# Altium project Kasli-SOC.PrjPcb (part 11 of 11)

## Sheet Kasli-SOC_ETH_PHY.SchDoc: Ethernet
size 420 x 297 mm; CheckedBy: G.Kasprowicz; Author: F.Switakowski; CompanyName: WUT ISE; DrawnBy: F.Switakowski; Organization: WUT ISE; Address1: PW ISE; Address2: Nowowiejska 15/19 00-665 Warsaw; Address3: gkasprow@gmail.com; DocumentNumber: 13; Revision: 1; SheetNumber: 13; SheetTotal: 18; ModifiedBy: -; CheckedDate: -; Title2: PHY; DivGrp: WUT ISE; Designer: G.Kasprowicz; ModifiedDate: -; ProjectName: Sensor Box
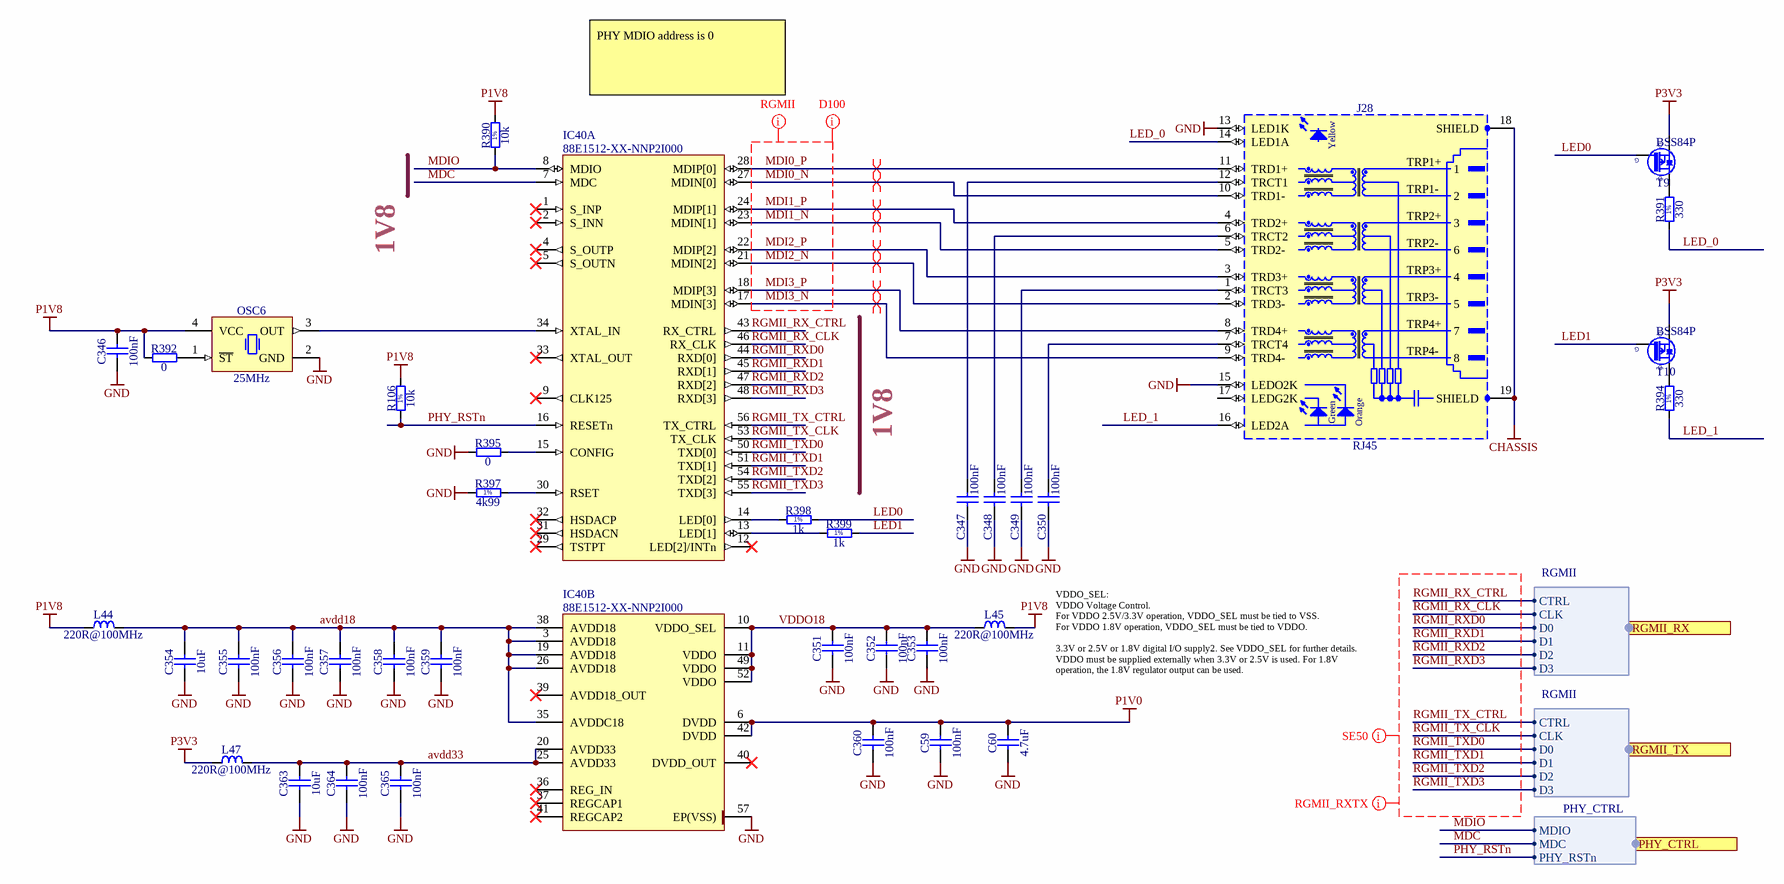
[diagram p17: Kasli-SOC_ETH_PHY.SchDoc]

### Parts
C59  100nF  [CAPC0603X33N]
C60  4.7uF  [CAPC1709X95N]
C346  100nF  [CAPC1005X55N]
C347  100nF  [CAPC1005X55N]
C348  100nF  [CAPC1005X55N]
C349  100nF  [CAPC1005X55N]
C350  100nF  [CAPC1005X55N]
C351  100nF  [CAPC0603X33N]
C352  100nF  [CAPC0603X33N]
C353  100nF  [CAPC0603X33N]
C354  10uF  [CAPC1608X80N]
C355  100nF  [CAPC0603X33N]
C356  100nF  [CAPC0603X33N]
C357  100nF  [CAPC0603X33N]
C358  100nF  [CAPC0603X33N]
C359  100nF  [CAPC0603X33N]
C360  100nF  [CAPC0603X33N]
C363  10uF  [CAPC1608X80N]
C364  100nF  [CAPC0603X33N]
C365  100nF  [CAPC0603X33N]
IC40  88E1512-XX-NNP2I000  [QFN50P800X800X100-57N-S437]  (parts A,B of 2)
J28  RJ45  [BEL_L829-1J1T-43]
L44  220R@100MHz  [INDC2012X105N]
L45  220R@100MHz  [INDC2012X105N]
L47  220R@100MHz  [INDC2012X105N]
OSC6  25MHz  [OSC_MICREL_2520]
R106  10k  [RESC1005X40N]
R390  10k  [RESC1005X40N]
R391  330  [RESC1005X40N]
R392  0  [RESC1005X40N]
R394  330  [RESC1005X40N]
R395  0  [RESC1005X40N]
R397  4k99  [RESC1608X55N]
R398  1k  [RESC1005X40N]
R399  1k  [RESC1005X40N]
T9  BSS84P  [SOT95P240X110-3N]
T10  BSS84P  [SOT95P240X110-3N]

### Ports
PHY_CTRL (harness PHY_CTRL), RGMII_RX (harness RGMII), RGMII_TX (harness RGMII)

### Harnesses
RGMII: CTRL, CLK, D0, D1, D2, D3
PHY_CTRL: MDIO, MDC, PHY_RSTn

### Nets
CHASSIS: J28.18(SHIELD) J28.19(SHIELD)
GND: C59.1 C60.1 C346.1 C347.1 C348.1 C349.1 C350.1 C351.1 C352.1 C353.1 C354.1 C355.1 C356.1 C357.1 C358.1 C359.1 C360.1 C363.1 C364.1 C365.1 IC40.57(EP(VSS)) J28.13(LED1K) J28.15(LEDO2K) OSC6.2(GND) R395.1 R397.1
P1V0: C59.2 C60.2 C360.2 IC40.6(DVDD) IC40.42(DVDD)
P1V8: C346.2 L44.1 L45.2 OSC6.4(VCC) R106.2 R390.2 R392.1
P3V3: L47.1 T9.2(S) T10.2(S)
avdd18: C354.2 C355.2 C356.2 C357.2 C358.2 C359.2 IC40.3(AVDD18) IC40.19(AVDD18) IC40.26(AVDD18) IC40.35(AVDDC18) IC40.38(AVDD18) L44.2
avdd33: C363.2 C364.2 C365.2 IC40.20(AVDD33) IC40.25(AVDD33) L47.2
LED0: R398.2 T9.1(G)
LED1: R399.2 T10.1(G)
LED_0: J28.14(LED1A) R391.1
LED_1: J28.16(LED2A) R394.1
MDC: IC40.7(MDC) ; port PHY_CTRL.MDC
MDI0_N: IC40.27(MDIN[0]) J28.10(TRD1-)
MDI0_P: IC40.28(MDIP[0]) J28.11(TRD1+)
MDI1_N: IC40.23(MDIN[1]) J28.5(TRD2-)
MDI1_P: IC40.24(MDIP[1]) J28.4(TRD2+)
MDI2_N: IC40.21(MDIN[2]) J28.2(TRD3-)
MDI2_P: IC40.22(MDIP[2]) J28.3(TRD3+)
MDI3_N: IC40.17(MDIN[3]) J28.9(TRD4-)
MDI3_P: IC40.18(MDIP[3]) J28.8(TRD4+)
MDIO: IC40.8(MDIO) R390.1 ; port PHY_CTRL.MDIO
PHY_RSTn: IC40.16(RESETn) R106.1 ; port PHY_CTRL.PHY_RSTn
RGMII_RX_CLK: IC40.46(RX_CLK) ; port RGMII_RX.CLK
RGMII_RX_CTRL: IC40.43(RX_CTRL) ; port RGMII_RX.CTRL
RGMII_RXD0: IC40.44(RXD[0]) ; port RGMII_RX.D0
RGMII_RXD1: IC40.45(RXD[1]) ; port RGMII_RX.D1
RGMII_RXD2: IC40.47(RXD[2]) ; port RGMII_RX.D2
RGMII_RXD3: IC40.48(RXD[3]) ; port RGMII_RX.D3
RGMII_TX_CLK: IC40.53(TX_CLK) ; port RGMII_TX.CLK
RGMII_TX_CTRL: IC40.56(TX_CTRL) ; port RGMII_TX.CTRL
RGMII_TXD0: IC40.50(TXD[0]) ; port RGMII_TX.D0
RGMII_TXD1: IC40.51(TXD[1]) ; port RGMII_TX.D1
RGMII_TXD2: IC40.54(TXD[2]) ; port RGMII_TX.D2
RGMII_TXD3: IC40.55(TXD[3]) ; port RGMII_TX.D3
VDDO18: C351.2 C352.2 C353.2 IC40.10(VDDO_SEL) IC40.11(VDDO) IC40.49(VDDO) IC40.52(VDDO) L45.1
NetC347_2: C347.2 J28.12(TRCT1)
NetC348_2: C348.2 J28.6(TRCT2)
NetC349_2: C349.2 J28.1(TRCT3)
NetC350_2: C350.2 J28.7(TRCT4)
NetIC40_13: IC40.13(LED[1]) R399.1
NetIC40_14: IC40.14(LED[0]) R398.1
NetIC40_15: IC40.15(CONFIG) R395.2
NetIC40_30: IC40.30(RSET) R397.2
NetIC40_34: IC40.34(XTAL_IN) OSC6.3(OUT)
NetOSC6_1: OSC6.1(~{ST}) R392.2
NetR391_2: R391.2 T9.3(D)
NetR394_2: R394.2 T10.3(D)

Not connected (* = marked no-connect by the designer): IC40 1(S_INP)* 2(S_INN)* 4(S_OUTP)* 5(S_OUTN)* 9(CLK125)* 12(LED[2]/INTn)* 29(TSTPT)* 31(HSDACN)* 32(HSDACP)* 33(XTAL_OUT)* 36(REG_IN)* 37(REGCAP1)* 39(AVDD18_OUT)* 40(DVDD_OUT)* 41(REGCAP2)*; J28 17(LEDG2K)

### Layout directives
differential pair: MDI0_N, MDI0_P, MDI1_N, MDI1_P, MDI2_N, MDI2_P, MDI3_N, MDI3_P
net class RGMII: MDI0_N, MDI0_P, MDI1_N, MDI1_P, MDI2_N, MDI2_P, MDI3_N, MDI3_P
net class RGMII_RXTX: RGMII_RX_CLK, RGMII_RX_CTRL, RGMII_RXD0, RGMII_RXD1, RGMII_RXD2, RGMII_RXD3, RGMII_TX_CLK, RGMII_TX_CTRL, RGMII_TXD0, RGMII_TXD1, RGMII_TXD2, RGMII_TXD3
net class D100: MDI0_N, MDI0_P, MDI1_N, MDI1_P, MDI2_N, MDI2_P, MDI3_N, MDI3_P
net class SE50: RGMII_RX_CLK, RGMII_RX_CTRL, RGMII_RXD0, RGMII_RXD1, RGMII_RXD2, RGMII_RXD3, RGMII_TX_CLK, RGMII_TX_CTRL, RGMII_TXD0, RGMII_TXD1, RGMII_TXD2, RGMII_TXD3

### Notes on the sheet
- PHY MDIO address is 0
- 1V8
- (near L45) VDDO_SEL:
  VDDO Voltage Control.
  For VDDO 2.5V/3.3V operation, VDDO_SEL must be tied to VSS.
  For VDDO 1.8V operation, VDDO_SEL must be tied to VDDO.
- 3.3V or 2.5V or 1.8V digital I/O supply2. See VDDO_SEL for further details.
  VDDO must be supplied externally when 3.3V or 2.5V is used. For 1.8V
  operation, the 1.8V regulator output can be used.
- Project/Equipment
- Document
- Designer
- Drawn by
- Check.by
- Copyright WUT ISE 2020.
  This documentation describes Open Hardware and is licensed under the CERN OHL v.1.2. You may redistribute and modify this documentation under the terms of the CERN OHL v.1.2. (http://ohwr.org/CERNOHL). This documentation is distributed WITHOUT ANY EXPRESS OR IMPLIED WARRANTY, INCLUDING OF MERCHANTABILITY, SATISFACTORY QUALITY AND FITNESS FOR A PARTICULAR PURPOSE. Please see the CERN OHL v.1.2 for applicable conditions.
- Contact
- File
- Last Mod.
- Print Date
- Sheet
- Size
- A3
- of
- Rev
- (in symbol BELFUSE_L829-1J1T-43) Yellow; TRP1+; TRP1-; TRP2+; TRP2-; TRP3+; TRP3-; TRP4+; TRP4-; Green; Orange
- (in symbol R0402_1K_1%_0.0625W_100PPM) 1%
- (in symbol R0402_10K_1%_0.0625W_100PPM) 1%
- (in symbol R0402_330R_1%_0.0625W_100PPM) 1%
- (in symbol R0603_4K99_1%_0.063W_50PPM) 1%

### Library data of the parts
C59 C351-C353 C355-C360 C364 C365 = CC0201_100NF_6.3V_10%_X5R: Non-polarised capacitor; Part Description: SMD Multilayer Chip Ceramic Capacitor; Manufacturer: GENERIC; Manufacturer1 Part Number: 02016D104KAT2A; Voltage: 6.3V; TC: X5R; Tolerance: ±10%; Part Number: CC0201_100NF_6.3V_10%_X5R; Component Kind: Standard; Component Type: Standard; Pin Count: 2; Value: 100nF; Status: Not Recommended; Manufacturer Part Number: CC0201_100NF_6.3V_10%_X5R; Case: 0201; Mounted: Yes; Socket: No; SMD: Yes; Sense: No; Manufacturer1 Example: AVX; Manufacturer1 ComponentHeight: 0.33mm; HelpURL: \\cern.ch\dfs\Applications\Altium\Datasheets\CC0201_X5R_AVX.pdf; Author: CERN DEM JLC; CreateDate: 03.12.2007; LatestRevisionDate: 03.12.2007
C60 = CC0603_4.7UF_16V_10%_X5R: Non-polarised capacitor; Part Description: SMD Multilayer Chip Ceramic Capacitor; Manufacturer: GENERIC; Manufacturer1 Part Number: EMK107ABJ475KA-T; Voltage: 16V; TC: X5R; Tolerance: ±10%; Part Number: CC0603_4.7UF_16V_10%_X5R; Component Kind: Standard; Component Type: Standard; Pin Count: 2; Value: 4.7uF; Status: None; Manufacturer Part Number: CC0603_4.7UF_16V_10%_X5R; Case: 0603; Mounted: Yes; Socket: No; SMD: Yes; Sense: No; Manufacturer1 Example: TAIYO YUDEN; Manufacturer1 ComponentHeight: 0.95mm; HelpURL: \\cern.ch\dfs\Applications\Altium\Datasheets\CC0603_X7R_TAIYO-YUDEN_HIGH-VALUE.pdf; Author: CERN DEM JLC; CreateDate: 16.12.2013; LatestRevisionDate: 16.09.2014
C346-C350 = CC0402_100NF_16V_10%_X7R: as C146-C153 on sheet Kasli-SOC_QUAD_BUCK; Part Number: CC0402_100NF_16V_10%_X7R; Component Kind: Standard; Component Type: Standard; Pin Count: 2; Value: 100nF; Status: Not Recommended; Manufacturer Part Number: CC0402_100NF_16V_10%_X7R; Case: 0402; Mounted: Yes; Socket: No; SMD: Yes; Sense: No; Manufacturer1 Example: MURATA; Manufacturer1 ComponentHeight: 0.55mm; HelpURL: \\cern.ch\dfs\Applications\Altium\Datasheets\CC0402_X7R_MURATA_GRM.pdf; Author: CERN DEM JLC; CreateDate: 05/12/2013; LatestRevisionDate: 03/12/2007
C354 C363 = CC0603_10UF_16V_20%_X5R: Non-polarised capacitor; Part Description: SMD Multilayer Chip Ceramic Capacitor; Manufacturer: GENERIC; Manufacturer1 Part Number: GRM188R61C106MA73D; Voltage: 16V; TC: X5R; Tolerance: ±20%; Part Number: CC0603_10UF_16V_20%_X5R; Component Kind: Standard; Component Type: Standard; Pin Count: 2; Value: 10uF; Status: None; Manufacturer Part Number: CC0603_10UF_16V_20%_X5R; Case: 0603; Mounted: Yes; Socket: No; SMD: Yes; Sense: No; Manufacturer1 Example: MURATA; Manufacturer1 ComponentHeight: 0.8mm; HelpURL: \\cern.ch\dfs\Applications\Altium\Datasheets\CC0603_X5R_MURATA_GRM.pdf; Author: CERN DEM MR; CreateDate: 02.03.2016; LatestRevisionDate: 02.03.2016
IC40 = 88E1512-XX-NNP2I000: Alaska Integrated 10/100/1000 Mbps Energy Efficient Ethernet Transceiver; Manufacturer: MARVELL  TECHNOLOGY; PressFit: No; Bonding: No; Part Number: 88E1512-XX-NNP2I000; Component Kind: Standard; Component Type: Standard; Device: 88E1512-XX-NNP2I000; PackageDescription: QFN, 0.50mm Pitch, Square; 56 Pin, 8.00mm L X 8.00mm W X 1.00mm H Body (4.37mm X 4.37mm Thermal Tab), IPC Medium Density; Part Description: Alaska Integrated 10/100/1000 Mbps Energy Efficient Ethernet Transceiver; Manufacturer Part Number: 88E1512-XX-NNP2I000; Pin Count: 57; Case: QFN56; Mounted: Yes; Socket: No; SMD: Yes; Sense: No; ComponentHeight: 1mm; Author: CERN DEM JLC; HelpURL: \\cern.ch\dfs\Applications\Altium\Datasheets\88E1512-XX-NNP2I000.pdf; CreateDate: 21.01.2015; LatestRevisionDate: 21.01.2015
J28 = BELFUSE_L829-1J1T-43: 1 Port, RJ45, Gigabit Ethernet, MagJack Connector Module With Yellow And Green/Orange LEDs; Part Description: 1 Port, Yellow/ Green-Orange LEDs,  RJ45 10/100/1000 Gigabit Ethernet, MagJack® Connector Module; Manufacturer: BEL MAGNETIC SOLUTIONS; PressFit: No; Part Number: BELFUSE_L829-1J1T-43; Component Kind: Standard; Component Type: Standard; Pin Count: 19; Family: RJ45; Mounted: Yes; Socket: No; SMD: No; Sense: No; Status: None; Manufacturer Part Number: L829-1J1T-43; ComponentHeight: 13.3mm; HelpURL: \\cern.ch\dfs\Applications\Altium\Datasheets\BEL_L829-1J1T-43.pdf; Author: CERN DEM JLC; CreateDate: 22.08.2011; LatestRevisionDate: 20.09.2018
L44 L45 L47 = IND0805_MURATA_BLM21PG221SN1D: Inductor; Part Description: SMD EMIFIL Suppression Chip Ferrite Bead; Manufacturer: MURATA; Power: 2A; Resistance: 0.05R; Tolerance: ±25%; Part Number: IND0805_MURATA_BLM21PG221SN1D; Component Kind: Standard; Component Type: Standard; Pin Count: 2; Value: 220R@100MHz; Status: None; Manufacturer Part Number: BLM21PG221SN1D; Case: 0805; Mounted: Yes; Socket: No; SMD: Yes; Sense: No; ComponentHeight: 1.05mm; HelpURL: \\cern.ch\dfs\Applications\Altium\Datasheets\IND0805_MURATA_BLM21P.pdf; Author: CERN DEM JLC; CreateDate: 25/01/2010; LatestRevisionDate: 25/01/2010
OSC6 = OSC_25MHZ_MICREL_DSC1001DI5-025.0000T: Oscillator 4 pins 1=\ST 2=GND 3=OUT 4=VCC; Part Description: 1.8V-3.3V, ±10ppm, 15pF,-40..85°C, HCMOS/TTL Surface Mount Low-Power Precision CMOS Oscillator (DSC1001 Series); Manufacturer: MICREL; PressFit: No; Bonding: No; Part Number: OSC_25MHZ_MICREL_DSC1001DI5-025.0000T; Component Kind: Standard; Component Type: Standard; PackageDescription: MICREL SMD Oscillator, QFN, 4 pins, 2.5mm x 2.0mm; Value: 25MHz; Manufacturer Part Number: DSC1001DI5-025.0000T; Pin Count: 4; Mounted: Yes; Socket: No; SMD: Yes; Sense: No; ComponentHeight: 0.9mm; HelpURL: \\cern.ch\dfs\Applications\Altium\Datasheets\OSC_MICREL_DSC1001.pdf; Author: CERN DEM JLC; CreateDate: 22.01.2015; LatestRevisionDate: 01.04.2015
R106 R390 = R0402_10K_1%_0.0625W_100PPM: Resistor - 1%; Part Description: General Purpose Thick Film Chip Resistor; Manufacturer: GENERIC; Manufacturer1 Part Number: 232270671003L; TC: ±100ppm/°C; PressFit: No; Part Number: R0402_10K_1%_0.0625W_100PPM; Component Kind: Standard; Component Type: Standard; Pin Count: 2; Value: 10k; Status: Not Recommended; Power: 0.0625W; Tolerance: ±1%; Manufacturer Part Number: R0402_10K_1%_0.0625W_100PPM; Case: 0402; Mounted: Yes; Sense: No; Socket: No; SMD: Yes; Manufacturer1 Example: YAGEO PHYCOMP; Manufacturer1 ComponentHeight: 0.4mm; HelpURL: \\cern.ch\dfs\Applications\Altium\Datasheets\R0402_Phycomp_RC0402.pdf; Author: CERN DEM JLC; CreateDate: 03.12.2007; LatestRevisionDate: 17.10.2012
R391 R394 = R0402_330R_1%_0.0625W_100PPM: Resistor - 1%; Part Description: General Purpose Thick Film Chip Resistor; Manufacturer: GENERIC; Manufacturer1 Part Number: 232270673301L; TC: ±100ppm/°C; PressFit: No; Part Number: R0402_330R_1%_0.0625W_100PPM; Component Kind: Standard; Component Type: Standard; Pin Count: 2; Value: 330; Status: Not Recommended; Power: 0.0625W; Tolerance: ±1%; Manufacturer Part Number: R0402_330R_1%_0.0625W_100PPM; Case: 0402; Mounted: Yes; Sense: No; Socket: No; SMD: Yes; Manufacturer1 Example: YAGEO PHYCOMP; Manufacturer1 ComponentHeight: 0.4mm; HelpURL: \\cern.ch\dfs\Applications\Altium\Datasheets\R0402_Phycomp_RC0402.pdf; Author: CERN DEM JLC; CreateDate: 03.12.2007; LatestRevisionDate: 17.10.2012
R392 R395 = R0402_0R_JUMPER: Resistor; Part Description: 1A (0.05R Max DC Resistance) Zero Ohm Jumper; Manufacturer: GENERIC; Manufacturer1 Part Number: 232270591001L; PressFit: No; Part Number: R0402_0R_JUMPER; Component Kind: Standard; Component Type: Standard; Pin Count: 2; Value: 0; Status: Not Recommended; Manufacturer Part Number: R0402_0R_JUMPER; Case: 0402; Mounted: Yes; Sense: No; Socket: No; SMD: Yes; Manufacturer1 Example: YAGEO PHYCOMP; Manufacturer1 ComponentHeight: 0.4mm; HelpURL: \\cern.ch\dfs\Applications\Altium\Datasheets\R0402_Phycomp_RC0402.pdf; Author: CERN DEM JLC; CreateDate: 03.12.2007; LatestRevisionDate: 17.10.2012
R397 = R0603_4K99_1%_0.063W_50PPM: Resistor - 1%; Part Description: General Purpose Thick Film Chip Resistor; Manufacturer: GENERIC; Manufacturer1 Part Number: CPF0603F4K99C1; Power: 0.063W; TC: ±50ppm/°C; PressFit: No; Part Number: R0603_4K99_1%_0.063W_50PPM; Component Kind: Standard; Component Type: Standard; Pin Count: 2; Value: 4k99; Status: None; Tolerance: ±1%; Manufacturer Part Number: R0603_4K99_1%_0.063W_50PPM; Case: 0603; Mounted: Yes; Sense: No; Socket: No; SMD: Yes; Manufacturer1 Example: TYCO NEOHM; Manufacturer1 ComponentHeight: 0.55mm; HelpURL: \\cern.ch\dfs\Applications\Altium\Datasheets\R0603_TYCO_CPF.pdf; Author: CERN DEM JLC; CreateDate: 20.05.2010; LatestRevisionDate: 20.05.2010
R398 R399 = R0402_1K_1%_0.0625W_100PPM: Resistor - 1%; Part Description: General Purpose Thick Film Chip Resistor; Manufacturer: GENERIC; Manufacturer1 Part Number: 232270671002L; TC: ±100ppm/°C; PressFit: No; Part Number: R0402_1K_1%_0.0625W_100PPM; Component Kind: Standard; Component Type: Standard; Pin Count: 2; Value: 1k; Status: Not Recommended; Power: 0.0625W; Tolerance: ±1%; Manufacturer Part Number: R0402_1K_1%_0.0625W_100PPM; Case: 0402; Mounted: Yes; Sense: No; Socket: No; SMD: Yes; Manufacturer1 Example: YAGEO PHYCOMP; Manufacturer1 ComponentHeight: 0.4mm; HelpURL: \\cern.ch\dfs\Applications\Altium\Datasheets\R0402_Phycomp_RC0402.pdf; Author: CERN DEM JLC; CreateDate: 03.12.2007; LatestRevisionDate: 17.10.2012
T9 T10 = BSS84P: P-CHANNEL MOSFET WITH DIODE; Part Description: -60V -170mA P-Channel SIPMOS Small-Signal Transistor; Manufacturer: INFINEON; PressFit: No; Bonding: No; Part Number: BSS84P; Component Kind: Standard; Component Type: Standard; Device: BSS84P; PackageDescription: SOT23 3-Leads, Pitch 0.95mm - Body 1.4x3mm, IPC Medium Density; Manufacturer Part Number: BSS84P; Pin Count: 3; Case: SOT23-3; Mounted: Yes; Socket: No; SMD: Yes; Sense: No; ComponentHeight: 1.1mm; HelpURL: \\cern.ch\dfs\Applications\Altium\Datasheets\BSS84P.pdf; Author: CERN DEM JLC; CreateDate: 11/07/2018; LatestRevisionDate: 11/07/2018

## Nets that join several sheets
CHASSIS: Kasli-SOC_top (6 pins), Kasli-SOC_SFP (J19.SHIELD), Kasli-SOC_ETH_PHY (J28.18 J28.19)
GND: Kasli-SOC_top (8 pins), Kasli-SOC_bank33-34-35 (R65.1), Kasli-SOC_power (178 pins), Kasli-SOC_bank112 (C68.1 OSC4.3), Kasli-SOC_bank500-501 (37 pins), Kasli-SOC_bank502_DDR (82 pins), Kasli-SOC_bank13 (9 pins), Kasli-SOC_IDC_EXT_Connectors (132 pins), Kasli-SOC_SFP (72 pins), Kasli-SOC_MUX_I2C (54 pins), Kasli-SOC_ClockRecovery (104 pins), Kasli-SOC_USB_Serial_Quad (59 pins), Kasli-SOC_PWR (45 pins), Kasli-SOC_QUAD_BUCK (60 pins), Kasli-SOC_linear (81 pins), Kasli-SOC_bank0 (13 pins), Kasli-SOC_ETH_PHY (26 pins)
GND_ADC: Kasli-SOC_power (C324.1 L11.2), Kasli-SOC_bank0 (IC6.N13 IC6.N14 IC6.P13 IC6.P14)
MGT_AVCC: Kasli-SOC_power (11 pins), Kasli-SOC_linear (C128.2 C129.2 L7.2 TP51.1)
MGT_AVTT: Kasli-SOC_power (11 pins), Kasli-SOC_bank112 (IC6.AB7 R66.2), Kasli-SOC_linear (B2.1 C121.2 C122.2 L5.2)
MGT_VCCAUX: Kasli-SOC_power (C229.2 IC6.V6), Kasli-SOC_linear (C133.2 C134.2 L8.2 TP41.1)
P1V0: Kasli-SOC_PWR (L13.1), Kasli-SOC_ETH_PHY (5 pins)
P1V0_VCCINT: Kasli-SOC_power (41 pins), Kasli-SOC_PWR (B6.1 L14.2 T8.1 TP9.1)
P1V8: Kasli-SOC_bank33-34-35 (R64.2), Kasli-SOC_power (30 pins), Kasli-SOC_bank500-501 (6 pins), Kasli-SOC_MUX_I2C (12 pins), Kasli-SOC_USB_Serial_Quad (C154.2 IC20.6), Kasli-SOC_PWR (L17.2 T15.1 TP12.1), Kasli-SOC_linear (L41.1), Kasli-SOC_ETH_PHY (7 pins)
P1V8_VCCAUX: Kasli-SOC_power (9 pins), Kasli-SOC_PWR (L26.2)
P1V8_VCCAUX_IO: Kasli-SOC_power (C240.2 IC6.M10 IC6.P10 IC6.T10), Kasli-SOC_PWR (L16.1)
P1V8_VCCPAUX: Kasli-SOC_power (10 pins), Kasli-SOC_PWR (L15.1)
P2V5: Kasli-SOC_top (R404.2), Kasli-SOC_power (20 pins), Kasli-SOC_bank112 (L4.1 OSC4.2), Kasli-SOC_bank500-501 (C50.1 IC4.5 R107.2), Kasli-SOC_bank13 (D18.1 R61.2 R154.2 TP38.1), Kasli-SOC_ClockRecovery (10 pins), Kasli-SOC_USB_Serial_Quad (12 pins), Kasli-SOC_PWR (L28.2 T7.1 TP8.1), Kasli-SOC_linear (L12.1), Kasli-SOC_bank0 (10 pins)
P3V3: Kasli-SOC_power (7 pins), Kasli-SOC_bank500-501 (22 pins), Kasli-SOC_bank13 (R44.2 R226.2 TP32.1), Kasli-SOC_IDC_EXT_Connectors (24 pins), Kasli-SOC_SFP (32 pins), Kasli-SOC_MUX_I2C (68 pins), Kasli-SOC_USB_Serial_Quad (5 pins), Kasli-SOC_PWR (12 pins), Kasli-SOC_linear (7 pins), Kasli-SOC_ETH_PHY (L47.1 T9.2 T10.2)
P3V3_EEM: Kasli-SOC_IDC_EXT_Connectors (12 pins), Kasli-SOC_PWR (C384.2 D20.1 IC46.5)
P12V0: Kasli-SOC_bank13 (D17.1 J21.1), Kasli-SOC_ClockRecovery (5 pins), Kasli-SOC_PWR (22 pins), Kasli-SOC_QUAD_BUCK (L18.1)
P12V0_EEM: Kasli-SOC_IDC_EXT_Connectors (24 pins), Kasli-SOC_PWR (C250.2 D22.1 IC47.7 IC47.8)
P12V0_FLT: Kasli-SOC_PWR (R57.1 R382.1), Kasli-SOC_QUAD_BUCK (20 pins), Kasli-SOC_linear (C374.2 L27.1)
VCCDDR: Kasli-SOC_power (16 pins), Kasli-SOC_bank502_DDR (59 pins), Kasli-SOC_PWR (TP37.1), Kasli-SOC_linear (6 pins)
VREF_DDR: Kasli-SOC_bank502_DDR (12 pins), Kasli-SOC_linear (C329.2 IC12.6)
VTT_DDR: Kasli-SOC_bank502_DDR (33 pins), Kasli-SOC_linear (5 pins)
ASSY_Variant: Kasli-SOC_bank33-34-35 (IC6.J9), Kasli-SOC_MUX_I2C (R122.1 R123.2)
CK_FPGAIO_N: Kasli-SOC_bank13 (IC6.AD24), Kasli-SOC_ClockRecovery (C6.2 R210.2 R211.2)
CK_FPGAIO_P: Kasli-SOC_bank13 (IC6.AD23), Kasli-SOC_ClockRecovery (C4.2 R1.2 R2.2)
CK_GTP_N: Kasli-SOC_bank112 (IC6.R5), Kasli-SOC_ClockRecovery (C11.2)
CK_GTP_P: Kasli-SOC_bank112 (IC6.R6), Kasli-SOC_ClockRecovery (C8.2)
CKIN_SMA_N: Kasli-SOC_top (R13.2 TR1.3), Kasli-SOC_bank13 (IC6.AD21)
CKIN_SMA_P: Kasli-SOC_top (R80.2 TR1.1), Kasli-SOC_bank13 (IC6.AD20 R53.2)
CLK_SEL: Kasli-SOC_MUX_I2C (IC25.8 IC43.20), Kasli-SOC_ClockRecovery (IC1.32 R242.1 R243.2)
CLKREC_N: Kasli-SOC_bank33-34-35 (IC6.F7), Kasli-SOC_ClockRecovery (C2.1 R3.1)
CLKREC_P: Kasli-SOC_bank33-34-35 (IC6.G7), Kasli-SOC_ClockRecovery (C1.1 R3.2)
EEM_FLT_N: Kasli-SOC_MUX_I2C (IC24.8 IC42.20 R125.1 TP11.1), Kasli-SOC_PWR (IC46.6 IC47.13)
EEM_PWR_EN: Kasli-SOC_MUX_I2C (IC24.28 IC42.11 TP31.1), Kasli-SOC_PWR (IC46.2 IC47.16 R127.2 R150.2)
EEPROM_I2C_SCL: Kasli-SOC_bank33-34-35 (IC6.C8), Kasli-SOC_MUX_I2C (IC44.1 IC45.6 R116.1)
EEPROM_I2C_SDA: Kasli-SOC_bank33-34-35 (IC6.C7), Kasli-SOC_MUX_I2C (IC44.3 IC45.5 R115.1)
EN_1V0: Kasli-SOC_PWR (R382.2), Kasli-SOC_QUAD_BUCK (IC41.C6)
EN_1V8: Kasli-SOC_PWR (5 pins), Kasli-SOC_QUAD_BUCK (IC41.K7)
EN_2V5: Kasli-SOC_PWR (R387.2 R388.2), Kasli-SOC_QUAD_BUCK (IC41.F6)
EN_3V3: Kasli-SOC_PWR (R385.2 R386.2), Kasli-SOC_QUAD_BUCK (IC41.J6)
EN_MGTAVCC: Kasli-SOC_PWR (R366.2 R367.2), Kasli-SOC_linear (IC29.11 IC35.14)
EN_MGTAVTT: Kasli-SOC_PWR (R369.2 R370.2), Kasli-SOC_linear (IC23.11 IC34.14)
EN_MGTVCCAUX: Kasli-SOC_PWR (R375.2 R376.2), Kasli-SOC_linear (IC31.11 IC36.14)
EN_USB_JTAG: Kasli-SOC_USB_Serial_Quad (T13.1), Kasli-SOC_bank0 (C53.2 J8.13 R43.1)
EN_VCCDDR: Kasli-SOC_PWR (R372.2 R373.2), Kasli-SOC_linear (IC8.11 IC33.14)
EXT0.LVDS_0_N: Kasli-SOC_bank12 (IC6.AD14), Kasli-SOC_IDC_EXT_Connectors (J9.3)
EXT0.LVDS_0_P: Kasli-SOC_bank12 (IC6.AC14), Kasli-SOC_IDC_EXT_Connectors (J9.2)
EXT0.LVDS_1_N: Kasli-SOC_bank12 (IC6.AF17), Kasli-SOC_IDC_EXT_Connectors (J9.6)
EXT0.LVDS_1_P: Kasli-SOC_bank12 (IC6.AE17), Kasli-SOC_IDC_EXT_Connectors (J9.5)
EXT0.LVDS_2_N: Kasli-SOC_bank12 (IC6.AA17), Kasli-SOC_IDC_EXT_Connectors (J9.9)
EXT0.LVDS_2_P: Kasli-SOC_bank12 (IC6.Y17), Kasli-SOC_IDC_EXT_Connectors (J9.8)
EXT0.LVDS_3_N: Kasli-SOC_bank12 (IC6.AB16), Kasli-SOC_IDC_EXT_Connectors (J9.12)
EXT0.LVDS_3_P: Kasli-SOC_bank12 (IC6.AB17), Kasli-SOC_IDC_EXT_Connectors (J9.11)
EXT0.LVDS_4_N: Kasli-SOC_bank12 (IC6.AC16), Kasli-SOC_IDC_EXT_Connectors (J9.15)
EXT0.LVDS_4_P: Kasli-SOC_bank12 (IC6.AC17), Kasli-SOC_IDC_EXT_Connectors (J9.14)
EXT0.LVDS_5_N: Kasli-SOC_bank12 (IC6.AD15), Kasli-SOC_IDC_EXT_Connectors (J9.18)
EXT0.LVDS_5_P: Kasli-SOC_bank12 (IC6.AD16), Kasli-SOC_IDC_EXT_Connectors (J9.17)
EXT0.LVDS_6_N: Kasli-SOC_bank12 (IC6.Y15), Kasli-SOC_IDC_EXT_Connectors (J9.21)
EXT0.LVDS_6_P: Kasli-SOC_bank12 (IC6.Y16), Kasli-SOC_IDC_EXT_Connectors (J9.20)
EXT0.LVDS_7_N: Kasli-SOC_bank12 (IC6.W15), Kasli-SOC_IDC_EXT_Connectors (J9.24)
EXT0.LVDS_7_P: Kasli-SOC_bank12 (IC6.W16), Kasli-SOC_IDC_EXT_Connectors (J9.23)
EXT1.LVDS_0_N: Kasli-SOC_bank13 (IC6.AC22), Kasli-SOC_IDC_EXT_Connectors (J10.3)
EXT1.LVDS_0_P: Kasli-SOC_bank13 (IC6.AC21), Kasli-SOC_IDC_EXT_Connectors (J10.2)
EXT1.LVDS_1_N: Kasli-SOC_bank13 (IC6.AD26), Kasli-SOC_IDC_EXT_Connectors (J10.6)
EXT1.LVDS_1_P: Kasli-SOC_bank13 (IC6.AD25), Kasli-SOC_IDC_EXT_Connectors (J10.5)
EXT1.LVDS_2_N: Kasli-SOC_bank13 (IC6.AF25), Kasli-SOC_IDC_EXT_Connectors (J10.9)
EXT1.LVDS_2_P: Kasli-SOC_bank13 (IC6.AF24), Kasli-SOC_IDC_EXT_Connectors (J10.8)
EXT1.LVDS_3_N: Kasli-SOC_bank13 (IC6.AB22), Kasli-SOC_IDC_EXT_Connectors (J10.12)
EXT1.LVDS_3_P: Kasli-SOC_bank13 (IC6.AB21), Kasli-SOC_IDC_EXT_Connectors (J10.11)
EXT1.LVDS_4_N: Kasli-SOC_bank13 (IC6.AB25), Kasli-SOC_IDC_EXT_Connectors (J10.15)
EXT1.LVDS_4_P: Kasli-SOC_bank13 (IC6.AA25), Kasli-SOC_IDC_EXT_Connectors (J10.14)
EXT1.LVDS_5_N: Kasli-SOC_bank13 (IC6.AC19), Kasli-SOC_IDC_EXT_Connectors (J10.18)
EXT1.LVDS_5_P: Kasli-SOC_bank13 (IC6.AC18), Kasli-SOC_IDC_EXT_Connectors (J10.17)
EXT1.LVDS_6_N: Kasli-SOC_bank13 (IC6.AB19), Kasli-SOC_IDC_EXT_Connectors (J10.21)
EXT1.LVDS_6_P: Kasli-SOC_bank13 (IC6.AA19), Kasli-SOC_IDC_EXT_Connectors (J10.20)
EXT1.LVDS_7_N: Kasli-SOC_bank13 (IC6.W19), Kasli-SOC_IDC_EXT_Connectors (J10.24)
EXT1.LVDS_7_P: Kasli-SOC_bank13 (IC6.W18), Kasli-SOC_IDC_EXT_Connectors (J10.23)
EXT2.LVDS_0_N: Kasli-SOC_bank33-34-35 (IC6.H14), Kasli-SOC_IDC_EXT_Connectors (J11.3)
EXT2.LVDS_0_P: Kasli-SOC_bank33-34-35 (IC6.J14), Kasli-SOC_IDC_EXT_Connectors (J11.2)
EXT2.LVDS_1_N: Kasli-SOC_bank33-34-35 (IC6.D16), Kasli-SOC_IDC_EXT_Connectors (J11.6)
EXT2.LVDS_1_P: Kasli-SOC_bank33-34-35 (IC6.E16), Kasli-SOC_IDC_EXT_Connectors (J11.5)
EXT2.LVDS_2_N: Kasli-SOC_bank33-34-35 (IC6.A17), Kasli-SOC_IDC_EXT_Connectors (J11.9)
EXT2.LVDS_2_P: Kasli-SOC_bank33-34-35 (IC6.B17), Kasli-SOC_IDC_EXT_Connectors (J11.8)
EXT2.LVDS_3_N: Kasli-SOC_bank33-34-35 (IC6.C16), Kasli-SOC_IDC_EXT_Connectors (J11.12)
EXT2.LVDS_3_P: Kasli-SOC_bank33-34-35 (IC6.C17), Kasli-SOC_IDC_EXT_Connectors (J11.11)
EXT2.LVDS_4_N: Kasli-SOC_bank33-34-35 (IC6.B15), Kasli-SOC_IDC_EXT_Connectors (J11.15)
EXT2.LVDS_4_P: Kasli-SOC_bank33-34-35 (IC6.B16), Kasli-SOC_IDC_EXT_Connectors (J11.14)
EXT2.LVDS_5_N: Kasli-SOC_bank33-34-35 (IC6.G15), Kasli-SOC_IDC_EXT_Connectors (J11.18)
EXT2.LVDS_5_P: Kasli-SOC_bank33-34-35 (IC6.G16), Kasli-SOC_IDC_EXT_Connectors (J11.17)
EXT2.LVDS_6_N: Kasli-SOC_bank33-34-35 (IC6.B14), Kasli-SOC_IDC_EXT_Connectors (J11.21)
EXT2.LVDS_6_P: Kasli-SOC_bank33-34-35 (IC6.C14), Kasli-SOC_IDC_EXT_Connectors (J11.20)
EXT2.LVDS_7_N: Kasli-SOC_bank33-34-35 (IC6.A14), Kasli-SOC_IDC_EXT_Connectors (J11.24)
EXT2.LVDS_7_P: Kasli-SOC_bank33-34-35 (IC6.A15), Kasli-SOC_IDC_EXT_Connectors (J11.23)
EXT3.LVDS_0_N: Kasli-SOC_bank33-34-35 (IC6.E15), Kasli-SOC_IDC_EXT_Connectors (J12.3)
EXT3.LVDS_0_P: Kasli-SOC_bank33-34-35 (IC6.F15), Kasli-SOC_IDC_EXT_Connectors (J12.2)
EXT3.LVDS_1_N: Kasli-SOC_bank33-34-35 (IC6.J15), Kasli-SOC_IDC_EXT_Connectors (J12.6)
EXT3.LVDS_1_P: Kasli-SOC_bank33-34-35 (IC6.K15), Kasli-SOC_IDC_EXT_Connectors (J12.5)
EXT3.LVDS_2_N: Kasli-SOC_bank33-34-35 (IC6.C13), Kasli-SOC_IDC_EXT_Connectors (J12.9)
EXT3.LVDS_2_P: Kasli-SOC_bank33-34-35 (IC6.D13), Kasli-SOC_IDC_EXT_Connectors (J12.8)
EXT3.LVDS_3_N: Kasli-SOC_bank33-34-35 (IC6.A12), Kasli-SOC_IDC_EXT_Connectors (J12.12)
EXT3.LVDS_3_P: Kasli-SOC_bank33-34-35 (IC6.A13), Kasli-SOC_IDC_EXT_Connectors (J12.11)
EXT3.LVDS_4_N: Kasli-SOC_bank33-34-35 (IC6.B12), Kasli-SOC_IDC_EXT_Connectors (J12.15)
EXT3.LVDS_4_P: Kasli-SOC_bank33-34-35 (IC6.C12), Kasli-SOC_IDC_EXT_Connectors (J12.14)
EXT3.LVDS_5_N: Kasli-SOC_bank33-34-35 (IC6.E12), Kasli-SOC_IDC_EXT_Connectors (J12.18)
EXT3.LVDS_5_P: Kasli-SOC_bank33-34-35 (IC6.F12), Kasli-SOC_IDC_EXT_Connectors (J12.17)
EXT3.LVDS_6_N: Kasli-SOC_bank33-34-35 (IC6.D11), Kasli-SOC_IDC_EXT_Connectors (J12.21)
EXT3.LVDS_6_P: Kasli-SOC_bank33-34-35 (IC6.E11), Kasli-SOC_IDC_EXT_Connectors (J12.20)
EXT3.LVDS_7_N: Kasli-SOC_bank33-34-35 (IC6.D10), Kasli-SOC_IDC_EXT_Connectors (J12.24)
EXT3.LVDS_7_P: Kasli-SOC_bank33-34-35 (IC6.E10), Kasli-SOC_IDC_EXT_Connectors (J12.23)
EXT4.LVDS_0_N: Kasli-SOC_bank33-34-35 (IC6.D14), Kasli-SOC_IDC_EXT_Connectors (J13.3)
EXT4.LVDS_0_P: Kasli-SOC_bank33-34-35 (IC6.D15), Kasli-SOC_IDC_EXT_Connectors (J13.2)
EXT4.LVDS_1_N: Kasli-SOC_bank33-34-35 (IC6.F14), Kasli-SOC_IDC_EXT_Connectors (J13.6)
EXT4.LVDS_1_P: Kasli-SOC_bank33-34-35 (IC6.G14), Kasli-SOC_IDC_EXT_Connectors (J13.5)
EXT4.LVDS_2_N: Kasli-SOC_bank33-34-35 (IC6.E13), Kasli-SOC_IDC_EXT_Connectors (J13.9)
EXT4.LVDS_2_P: Kasli-SOC_bank33-34-35 (IC6.F13), Kasli-SOC_IDC_EXT_Connectors (J13.8)
EXT4.LVDS_3_N: Kasli-SOC_bank33-34-35 (IC6.G11), Kasli-SOC_IDC_EXT_Connectors (J13.12)
EXT4.LVDS_3_P: Kasli-SOC_bank33-34-35 (IC6.G12), Kasli-SOC_IDC_EXT_Connectors (J13.11)
EXT4.LVDS_4_N: Kasli-SOC_bank33-34-35 (IC6.H12), Kasli-SOC_IDC_EXT_Connectors (J13.15)
EXT4.LVDS_4_P: Kasli-SOC_bank33-34-35 (IC6.H13), Kasli-SOC_IDC_EXT_Connectors (J13.14)
EXT4.LVDS_5_N: Kasli-SOC_bank33-34-35 (IC6.J13), Kasli-SOC_IDC_EXT_Connectors (J13.18)
EXT4.LVDS_5_P: Kasli-SOC_bank33-34-35 (IC6.K13), Kasli-SOC_IDC_EXT_Connectors (J13.17)
EXT4.LVDS_6_N: Kasli-SOC_bank33-34-35 (IC6.B11), Kasli-SOC_IDC_EXT_Connectors (J13.21)
EXT4.LVDS_6_P: Kasli-SOC_bank33-34-35 (IC6.C11), Kasli-SOC_IDC_EXT_Connectors (J13.20)
EXT4.LVDS_7_N: Kasli-SOC_bank33-34-35 (IC6.F10), Kasli-SOC_IDC_EXT_Connectors (J13.24)
EXT4.LVDS_7_P: Kasli-SOC_bank33-34-35 (IC6.G10), Kasli-SOC_IDC_EXT_Connectors (J13.23)
EXT5.LVDS_0_N: Kasli-SOC_bank33-34-35 (IC6.E7), Kasli-SOC_IDC_EXT_Connectors (J14.3)
EXT5.LVDS_0_P: Kasli-SOC_bank33-34-35 (IC6.F8), Kasli-SOC_IDC_EXT_Connectors (J14.2)
EXT5.LVDS_1_N: Kasli-SOC_bank33-34-35 (IC6.A10), Kasli-SOC_IDC_EXT_Connectors (J14.6)
EXT5.LVDS_1_P: Kasli-SOC_bank33-34-35 (IC6.B10), Kasli-SOC_IDC_EXT_Connectors (J14.5)
EXT5.LVDS_2_N: Kasli-SOC_bank33-34-35 (IC6.H8), Kasli-SOC_IDC_EXT_Connectors (J14.9)
EXT5.LVDS_2_P: Kasli-SOC_bank33-34-35 (IC6.J8), Kasli-SOC_IDC_EXT_Connectors (J14.8)
EXT5.LVDS_3_N: Kasli-SOC_bank33-34-35 (IC6.A8), Kasli-SOC_IDC_EXT_Connectors (J14.12)
EXT5.LVDS_3_P: Kasli-SOC_bank33-34-35 (IC6.A9), Kasli-SOC_IDC_EXT_Connectors (J14.11)
EXT5.LVDS_4_N: Kasli-SOC_bank33-34-35 (IC6.D5), Kasli-SOC_IDC_EXT_Connectors (J14.15)
EXT5.LVDS_4_P: Kasli-SOC_bank33-34-35 (IC6.E6), Kasli-SOC_IDC_EXT_Connectors (J14.14)
EXT5.LVDS_5_N: Kasli-SOC_bank33-34-35 (IC6.E5), Kasli-SOC_IDC_EXT_Connectors (J14.18)
EXT5.LVDS_5_P: Kasli-SOC_bank33-34-35 (IC6.F5), Kasli-SOC_IDC_EXT_Connectors (J14.17)
EXT5.LVDS_6_N: Kasli-SOC_bank33-34-35 (IC6.G5), Kasli-SOC_IDC_EXT_Connectors (J14.21)
EXT5.LVDS_6_P: Kasli-SOC_bank33-34-35 (IC6.G6), Kasli-SOC_IDC_EXT_Connectors (J14.20)
EXT5.LVDS_7_N: Kasli-SOC_bank33-34-35 (IC6.H6), Kasli-SOC_IDC_EXT_Connectors (J14.24)
EXT5.LVDS_7_P: Kasli-SOC_bank33-34-35 (IC6.H7), Kasli-SOC_IDC_EXT_Connectors (J14.23)
EXT6.LVDS_0_N: Kasli-SOC_bank33-34-35 (IC6.C6), Kasli-SOC_IDC_EXT_Connectors (J15.3)
EXT6.LVDS_0_P: Kasli-SOC_bank33-34-35 (IC6.D6), Kasli-SOC_IDC_EXT_Connectors (J15.2)
EXT6.LVDS_1_N: Kasli-SOC_bank33-34-35 (IC6.A7), Kasli-SOC_IDC_EXT_Connectors (J15.6)
EXT6.LVDS_1_P: Kasli-SOC_bank33-34-35 (IC6.B7), Kasli-SOC_IDC_EXT_Connectors (J15.5)
EXT6.LVDS_2_N: Kasli-SOC_bank33-34-35 (IC6.B4), Kasli-SOC_IDC_EXT_Connectors (J15.9)
EXT6.LVDS_2_P: Kasli-SOC_bank33-34-35 (IC6.B5), Kasli-SOC_IDC_EXT_Connectors (J15.8)
EXT6.LVDS_3_N: Kasli-SOC_bank33-34-35 (IC6.C3), Kasli-SOC_IDC_EXT_Connectors (J15.12)
EXT6.LVDS_3_P: Kasli-SOC_bank33-34-35 (IC6.C4), Kasli-SOC_IDC_EXT_Connectors (J15.11)
EXT6.LVDS_4_N: Kasli-SOC_bank33-34-35 (IC6.A5), Kasli-SOC_IDC_EXT_Connectors (J15.15)
EXT6.LVDS_4_P: Kasli-SOC_bank33-34-35 (IC6.B6), Kasli-SOC_IDC_EXT_Connectors (J15.14)
EXT6.LVDS_5_N: Kasli-SOC_bank33-34-35 (IC6.A3), Kasli-SOC_IDC_EXT_Connectors (J15.18)
EXT6.LVDS_5_P: Kasli-SOC_bank33-34-35 (IC6.A4), Kasli-SOC_IDC_EXT_Connectors (J15.17)
EXT6.LVDS_6_N: Kasli-SOC_bank33-34-35 (IC6.B1), Kasli-SOC_IDC_EXT_Connectors (J15.21)
EXT6.LVDS_6_P: Kasli-SOC_bank33-34-35 (IC6.C2), Kasli-SOC_IDC_EXT_Connectors (J15.20)
EXT6.LVDS_7_N: Kasli-SOC_bank33-34-35 (IC6.A2), Kasli-SOC_IDC_EXT_Connectors (J15.24)
EXT6.LVDS_7_P: Kasli-SOC_bank33-34-35 (IC6.B2), Kasli-SOC_IDC_EXT_Connectors (J15.23)
EXT7.LVDS_0_N: Kasli-SOC_bank33-34-35 (IC6.K3), Kasli-SOC_IDC_EXT_Connectors (J16.3)
EXT7.LVDS_0_P: Kasli-SOC_bank33-34-35 (IC6.L3), Kasli-SOC_IDC_EXT_Connectors (J16.2)
EXT7.LVDS_1_N: Kasli-SOC_bank33-34-35 (IC6.D3), Kasli-SOC_IDC_EXT_Connectors (J16.6)
EXT7.LVDS_1_P: Kasli-SOC_bank33-34-35 (IC6.D4), Kasli-SOC_IDC_EXT_Connectors (J16.5)
EXT7.LVDS_2_N: Kasli-SOC_bank33-34-35 (IC6.F2), Kasli-SOC_IDC_EXT_Connectors (J16.9)
EXT7.LVDS_2_P: Kasli-SOC_bank33-34-35 (IC6.G2), Kasli-SOC_IDC_EXT_Connectors (J16.8)
EXT7.LVDS_3_N: Kasli-SOC_bank33-34-35 (IC6.C1), Kasli-SOC_IDC_EXT_Connectors (J16.12)
EXT7.LVDS_3_P: Kasli-SOC_bank33-34-35 (IC6.D1), Kasli-SOC_IDC_EXT_Connectors (J16.11)
EXT7.LVDS_4_N: Kasli-SOC_bank33-34-35 (IC6.E1), Kasli-SOC_IDC_EXT_Connectors (J16.15)
EXT7.LVDS_4_P: Kasli-SOC_bank33-34-35 (IC6.E2), Kasli-SOC_IDC_EXT_Connectors (J16.14)
EXT7.LVDS_5_N: Kasli-SOC_bank33-34-35 (IC6.E3), Kasli-SOC_IDC_EXT_Connectors (J16.18)
EXT7.LVDS_5_P: Kasli-SOC_bank33-34-35 (IC6.F3), Kasli-SOC_IDC_EXT_Connectors (J16.17)
EXT7.LVDS_6_N: Kasli-SOC_bank33-34-35 (IC6.H1), Kasli-SOC_IDC_EXT_Connectors (J16.21)
EXT7.LVDS_6_P: Kasli-SOC_bank33-34-35 (IC6.J1), Kasli-SOC_IDC_EXT_Connectors (J16.20)
EXT7.LVDS_7_N: Kasli-SOC_bank33-34-35 (IC6.H3), Kasli-SOC_IDC_EXT_Connectors (J16.24)
EXT7.LVDS_7_P: Kasli-SOC_bank33-34-35 (IC6.H4), Kasli-SOC_IDC_EXT_Connectors (J16.23)
EXT8.LVDS_0_N: Kasli-SOC_bank12 (IC6.AD11), Kasli-SOC_IDC_EXT_Connectors (J5.3)
EXT8.LVDS_0_P: Kasli-SOC_bank12 (IC6.AC12), Kasli-SOC_IDC_EXT_Connectors (J5.2)
EXT8.LVDS_1_N: Kasli-SOC_bank12 (IC6.AC11), Kasli-SOC_IDC_EXT_Connectors (J5.6)
EXT8.LVDS_1_P: Kasli-SOC_bank12 (IC6.AB12), Kasli-SOC_IDC_EXT_Connectors (J5.5)
EXT8.LVDS_2_N: Kasli-SOC_bank12 (IC6.AA10), Kasli-SOC_IDC_EXT_Connectors (J5.9)
EXT8.LVDS_2_P: Kasli-SOC_bank12 (IC6.Y10), Kasli-SOC_IDC_EXT_Connectors (J5.8)
EXT8.LVDS_3_N: Kasli-SOC_bank12 (IC6.AB10), Kasli-SOC_IDC_EXT_Connectors (J5.12)
EXT8.LVDS_3_P: Kasli-SOC_bank12 (IC6.AB11), Kasli-SOC_IDC_EXT_Connectors (J5.11)
EXT8.LVDS_4_N: Kasli-SOC_bank12 (IC6.Y13), Kasli-SOC_IDC_EXT_Connectors (J5.15)
EXT8.LVDS_4_P: Kasli-SOC_bank12 (IC6.W13), Kasli-SOC_IDC_EXT_Connectors (J5.14)
EXT8.LVDS_5_N: Kasli-SOC_bank12 (IC6.AA12), Kasli-SOC_IDC_EXT_Connectors (J5.18)
EXT8.LVDS_5_P: Kasli-SOC_bank12 (IC6.AA13), Kasli-SOC_IDC_EXT_Connectors (J5.17)
EXT8.LVDS_6_N: Kasli-SOC_bank12 (IC6.Y11), Kasli-SOC_IDC_EXT_Connectors (J5.21)
EXT8.LVDS_6_P: Kasli-SOC_bank12 (IC6.Y12), Kasli-SOC_IDC_EXT_Connectors (J5.20)
EXT8.LVDS_7_N: Kasli-SOC_bank12 (IC6.AE15), Kasli-SOC_IDC_EXT_Connectors (J5.24)
EXT8.LVDS_7_P: Kasli-SOC_bank12 (IC6.AE16), Kasli-SOC_IDC_EXT_Connectors (J5.23)
EXT9.LVDS_0_N: Kasli-SOC_bank12 (IC6.AD13), Kasli-SOC_IDC_EXT_Connectors (J6.3)
EXT9.LVDS_0_P: Kasli-SOC_bank12 (IC6.AC13), Kasli-SOC_IDC_EXT_Connectors (J6.2)
EXT9.LVDS_1_N: Kasli-SOC_bank12 (IC6.AF13), Kasli-SOC_IDC_EXT_Connectors (J6.6)
EXT9.LVDS_1_P: Kasli-SOC_bank12 (IC6.AE13), Kasli-SOC_IDC_EXT_Connectors (J6.5)
EXT9.LVDS_2_N: Kasli-SOC_bank12 (IC6.AD10), Kasli-SOC_IDC_EXT_Connectors (J6.9)
EXT9.LVDS_2_P: Kasli-SOC_bank12 (IC6.AE10), Kasli-SOC_IDC_EXT_Connectors (J6.8)
EXT9.LVDS_3_N: Kasli-SOC_bank12 (IC6.AF12), Kasli-SOC_IDC_EXT_Connectors (J6.12)
EXT9.LVDS_3_P: Kasli-SOC_bank12 (IC6.AE12), Kasli-SOC_IDC_EXT_Connectors (J6.11)
EXT9.LVDS_4_N: Kasli-SOC_bank12 (IC6.AF10), Kasli-SOC_IDC_EXT_Connectors (J6.15)
EXT9.LVDS_4_P: Kasli-SOC_bank12 (IC6.AE11), Kasli-SOC_IDC_EXT_Connectors (J6.14)
EXT9.LVDS_5_N: Kasli-SOC_bank12 (IC6.AB14), Kasli-SOC_IDC_EXT_Connectors (J6.18)
EXT9.LVDS_5_P: Kasli-SOC_bank12 (IC6.AB15), Kasli-SOC_IDC_EXT_Connectors (J6.17)
EXT9.LVDS_6_N: Kasli-SOC_bank12 (IC6.AA14), Kasli-SOC_IDC_EXT_Connectors (J6.21)
EXT9.LVDS_6_P: Kasli-SOC_bank12 (IC6.AA15), Kasli-SOC_IDC_EXT_Connectors (J6.20)
EXT9.LVDS_7_N: Kasli-SOC_bank12 (IC6.AF14), Kasli-SOC_IDC_EXT_Connectors (J6.24)
EXT9.LVDS_7_P: Kasli-SOC_bank12 (IC6.AF15), Kasli-SOC_IDC_EXT_Connectors (J6.23)
EXT10.LVDS_0_N: Kasli-SOC_bank33-34-35 (IC6.J3), Kasli-SOC_IDC_EXT_Connectors (J7.3)
EXT10.LVDS_0_P: Kasli-SOC_bank33-34-35 (IC6.J4), Kasli-SOC_IDC_EXT_Connectors (J7.2)
EXT10.LVDS_1_N: Kasli-SOC_bank33-34-35 (IC6.G1), Kasli-SOC_IDC_EXT_Connectors (J7.6)
EXT10.LVDS_1_P: Kasli-SOC_bank33-34-35 (IC6.H2), Kasli-SOC_IDC_EXT_Connectors (J7.5)
EXT10.LVDS_2_N: Kasli-SOC_bank33-34-35 (IC6.K1), Kasli-SOC_IDC_EXT_Connectors (J7.9)
EXT10.LVDS_2_P: Kasli-SOC_bank33-34-35 (IC6.K2), Kasli-SOC_IDC_EXT_Connectors (J7.8)
EXT10.LVDS_3_N: Kasli-SOC_bank33-34-35 (IC6.F4), Kasli-SOC_IDC_EXT_Connectors (J7.12)
EXT10.LVDS_3_P: Kasli-SOC_bank33-34-35 (IC6.G4), Kasli-SOC_IDC_EXT_Connectors (J7.11)
EXT10.LVDS_4_N: Kasli-SOC_bank33-34-35 (IC6.M4), Kasli-SOC_IDC_EXT_Connectors (J7.15)
EXT10.LVDS_4_P: Kasli-SOC_bank33-34-35 (IC6.N4), Kasli-SOC_IDC_EXT_Connectors (J7.14)
EXT10.LVDS_5_N: Kasli-SOC_bank33-34-35 (IC6.L4), Kasli-SOC_IDC_EXT_Connectors (J7.18)
EXT10.LVDS_5_P: Kasli-SOC_bank33-34-35 (IC6.L5), Kasli-SOC_IDC_EXT_Connectors (J7.17)
EXT10.LVDS_6_N: Kasli-SOC_bank33-34-35 (IC6.N2), Kasli-SOC_IDC_EXT_Connectors (J7.21)
EXT10.LVDS_6_P: Kasli-SOC_bank33-34-35 (IC6.N3), Kasli-SOC_IDC_EXT_Connectors (J7.20)
EXT10.LVDS_7_N: Kasli-SOC_bank33-34-35 (IC6.L2), Kasli-SOC_IDC_EXT_Connectors (J7.24)
EXT10.LVDS_7_P: Kasli-SOC_bank33-34-35 (IC6.M2), Kasli-SOC_IDC_EXT_Connectors (J7.23)
EXT11.LVDS_0_N: Kasli-SOC_bank33-34-35 (IC6.M5), Kasli-SOC_IDC_EXT_Connectors (J17.3)
EXT11.LVDS_0_P: Kasli-SOC_bank33-34-35 (IC6.M6), Kasli-SOC_IDC_EXT_Connectors (J17.2)
EXT11.LVDS_1_N: Kasli-SOC_bank33-34-35 (IC6.M1), Kasli-SOC_IDC_EXT_Connectors (J17.6)
EXT11.LVDS_1_P: Kasli-SOC_bank33-34-35 (IC6.N1), Kasli-SOC_IDC_EXT_Connectors (J17.5)
EXT11.LVDS_2_N: Kasli-SOC_bank33-34-35 (IC6.L7), Kasli-SOC_IDC_EXT_Connectors (J17.9)
EXT11.LVDS_2_P: Kasli-SOC_bank33-34-35 (IC6.M7), Kasli-SOC_IDC_EXT_Connectors (J17.8)
EXT11.LVDS_3_N: Kasli-SOC_bank33-34-35 (IC6.J5), Kasli-SOC_IDC_EXT_Connectors (J17.12)
EXT11.LVDS_3_P: Kasli-SOC_bank33-34-35 (IC6.K5), Kasli-SOC_IDC_EXT_Connectors (J17.11)
EXT11.LVDS_4_N: Kasli-SOC_bank33-34-35 (IC6.L8), Kasli-SOC_IDC_EXT_Connectors (J17.15)
EXT11.LVDS_4_P: Kasli-SOC_bank33-34-35 (IC6.M8), Kasli-SOC_IDC_EXT_Connectors (J17.14)
EXT11.LVDS_5_N: Kasli-SOC_bank33-34-35 (IC6.J6), Kasli-SOC_IDC_EXT_Connectors (J17.18)
EXT11.LVDS_5_P: Kasli-SOC_bank33-34-35 (IC6.K6), Kasli-SOC_IDC_EXT_Connectors (J17.17)
EXT11.LVDS_6_N: Kasli-SOC_bank33-34-35 (IC6.N6), Kasli-SOC_IDC_EXT_Connectors (J17.21)
EXT11.LVDS_6_P: Kasli-SOC_bank33-34-35 (IC6.N7), Kasli-SOC_IDC_EXT_Connectors (J17.20)
EXT11.LVDS_7_N: Kasli-SOC_bank33-34-35 (IC6.K7), Kasli-SOC_IDC_EXT_Connectors (J17.24)
EXT11.LVDS_7_P: Kasli-SOC_bank33-34-35 (IC6.K8), Kasli-SOC_IDC_EXT_Connectors (J17.23)
GPIO_INT0: Kasli-SOC_bank500-501 (IC6.D23), Kasli-SOC_MUX_I2C (IC25.20 IC43.1)
GPIO_INT1: Kasli-SOC_bank500-501 (IC6.C24), Kasli-SOC_MUX_I2C (IC24.20 IC42.1)
Helper_DCXO_N: Kasli-SOC_bank13 (IC6.AC24), Kasli-SOC_ClockRecovery (OSC3.5)
Helper_DCXO_OE: Kasli-SOC_bank13 (IC6.AA20), Kasli-SOC_ClockRecovery (R97.1 R98.2 R245.1 R247.2)
Helper_DCXO_P: Kasli-SOC_bank13 (IC6.AC23), Kasli-SOC_ClockRecovery (R225.2)
Helper_DCXO_SCL: Kasli-SOC_bank13 (IC6.AC26), Kasli-SOC_ClockRecovery (OSC3.8 R50.1 TP24.1)
Helper_DCXO_SDA: Kasli-SOC_bank13 (IC6.AB26), Kasli-SOC_ClockRecovery (OSC3.7 R41.1 TP23.1)
HW_REV0: Kasli-SOC_bank33-34-35 (IC6.E8), Kasli-SOC_MUX_I2C (R118.1)
HW_REV1: Kasli-SOC_bank33-34-35 (IC6.F9), Kasli-SOC_MUX_I2C (R119.1)
HW_REV2: Kasli-SOC_bank33-34-35 (IC6.G9), Kasli-SOC_MUX_I2C (R120.1)
HW_REV3: Kasli-SOC_bank33-34-35 (IC6.H11), Kasli-SOC_MUX_I2C (R121.1)
I2C_1V8_SW_SCL: Kasli-SOC_bank500-501 (IC6.B22), Kasli-SOC_MUX_I2C (IC13.3 R147.1 TP14.1)
I2C_1V8_SW_SDA: Kasli-SOC_bank500-501 (IC6.B20), Kasli-SOC_MUX_I2C (IC13.4 R146.1 TP13.1)
I2C_3V3_SW_SCL: Kasli-SOC_MUX_I2C (IC13.6 IC14.19 IC15.19 R149.1), Kasli-SOC_USB_Serial_Quad (IC22.3 TP19.1)
I2C_3V3_SW_SDA: Kasli-SOC_MUX_I2C (IC13.5 IC14.20 IC15.20 R148.1), Kasli-SOC_USB_Serial_Quad (IC22.4 TP18.1)
I2C_SCL_0: Kasli-SOC_IDC_EXT_Connectors (D3.3 J9.27), Kasli-SOC_MUX_I2C (IC14.17 R156.1)
I2C_SCL_1: Kasli-SOC_IDC_EXT_Connectors (D4.3 J10.27), Kasli-SOC_MUX_I2C (IC14.13 R158.1)
I2C_SCL_2: Kasli-SOC_IDC_EXT_Connectors (D5.3 J11.27), Kasli-SOC_MUX_I2C (IC14.11 R160.1)
I2C_SCL_3: Kasli-SOC_IDC_EXT_Connectors (D6.3 J12.27), Kasli-SOC_MUX_I2C (IC14.8 R162.1)
I2C_SCL_4: Kasli-SOC_IDC_EXT_Connectors (D7.3 J13.27), Kasli-SOC_MUX_I2C (IC14.6 R164.1)
I2C_SCL_5: Kasli-SOC_IDC_EXT_Connectors (D8.3 J14.27), Kasli-SOC_MUX_I2C (IC14.4 R166.1)
I2C_SCL_6: Kasli-SOC_IDC_EXT_Connectors (D9.3 J15.27), Kasli-SOC_MUX_I2C (IC14.2 R168.1)
I2C_SCL_7: Kasli-SOC_IDC_EXT_Connectors (D10.3 J16.27), Kasli-SOC_MUX_I2C (IC14.15 R170.1)
I2C_SCL_8: Kasli-SOC_IDC_EXT_Connectors (D11.3 J5.27), Kasli-SOC_MUX_I2C (IC15.11 R172.1)
I2C_SCL_9: Kasli-SOC_IDC_EXT_Connectors (D13.3 J6.27), Kasli-SOC_MUX_I2C (IC15.13 R175.1)
I2C_SCL_10: Kasli-SOC_IDC_EXT_Connectors (D12.3 J7.27), Kasli-SOC_MUX_I2C (IC15.17 R178.1)
I2C_SCL_11: Kasli-SOC_IDC_EXT_Connectors (D14.3 J17.27), Kasli-SOC_MUX_I2C (IC15.15 R182.1)
I2C_SDA_0: Kasli-SOC_IDC_EXT_Connectors (D3.2 J9.26), Kasli-SOC_MUX_I2C (IC14.16 R155.1)
I2C_SDA_1: Kasli-SOC_IDC_EXT_Connectors (D4.2 J10.26), Kasli-SOC_MUX_I2C (IC14.12 R157.1)
I2C_SDA_2: Kasli-SOC_IDC_EXT_Connectors (D5.2 J11.26), Kasli-SOC_MUX_I2C (IC14.10 R159.1)
I2C_SDA_3: Kasli-SOC_IDC_EXT_Connectors (D6.2 J12.26), Kasli-SOC_MUX_I2C (IC14.7 R161.1)
I2C_SDA_4: Kasli-SOC_IDC_EXT_Connectors (D7.2 J13.26), Kasli-SOC_MUX_I2C (IC14.5 R163.1)
I2C_SDA_5: Kasli-SOC_IDC_EXT_Connectors (D8.2 J14.26), Kasli-SOC_MUX_I2C (IC14.3 R165.1)
I2C_SDA_6: Kasli-SOC_IDC_EXT_Connectors (D9.2 J15.26), Kasli-SOC_MUX_I2C (IC14.1 R167.1)
I2C_SDA_7: Kasli-SOC_IDC_EXT_Connectors (D10.2 J16.26), Kasli-SOC_MUX_I2C (IC14.14 R169.1)
I2C_SDA_8: Kasli-SOC_IDC_EXT_Connectors (D11.2 J5.26), Kasli-SOC_MUX_I2C (IC15.10 R171.1)
I2C_SDA_9: Kasli-SOC_IDC_EXT_Connectors (D13.2 J6.26), Kasli-SOC_MUX_I2C (IC15.12 R173.1)
I2C_SDA_10: Kasli-SOC_IDC_EXT_Connectors (D12.2 J7.26), Kasli-SOC_MUX_I2C (IC15.16 R176.1)
I2C_SDA_11: Kasli-SOC_IDC_EXT_Connectors (D14.2 J17.26), Kasli-SOC_MUX_I2C (IC15.14 R180.1)
I2C_SW_RESET: Kasli-SOC_bank500-501 (IC6.E22), Kasli-SOC_MUX_I2C (R33.2 T21.1)
I2C_SW_RESET2: Kasli-SOC_MUX_I2C (R46.2 T22.1), Kasli-SOC_USB_Serial_Quad (IC18.27)
LTM_1V0_OUT: Kasli-SOC_PWR (L13.2 L14.1), Kasli-SOC_QUAD_BUCK (9 pins)
LTM_1V8_OUT: Kasli-SOC_PWR (L15.2 L16.2 L17.1 L26.1), Kasli-SOC_QUAD_BUCK (9 pins)
LTM_2V5_OUT: Kasli-SOC_PWR (L28.1), Kasli-SOC_QUAD_BUCK (9 pins)
LTM_3V3_OUT: Kasli-SOC_PWR (L39.1), Kasli-SOC_QUAD_BUCK (9 pins)
Main_DCXO_OE: Kasli-SOC_bank13 (IC6.AB20), Kasli-SOC_ClockRecovery (R36.1 R38.2 R244.1 R246.2)
Main_DCXO_SCL: Kasli-SOC_bank13 (IC6.AE22), Kasli-SOC_ClockRecovery (OSC1.8 R35.1 TP22.1)
Main_DCXO_SDA: Kasli-SOC_bank13 (IC6.AF22), Kasli-SOC_ClockRecovery (OSC1.7 R34.1 TP21.1)
MDC: Kasli-SOC_bank500-501 (IC6.A20), Kasli-SOC_ETH_PHY (IC40.7)
MDIO: Kasli-SOC_bank500-501 (IC6.A19), Kasli-SOC_ETH_PHY (IC40.8 R390.1)
PG_1V0: Kasli-SOC_PWR (R384.1), Kasli-SOC_QUAD_BUCK (IC41.C3)
PG_1V8: Kasli-SOC_PWR (R386.1), Kasli-SOC_QUAD_BUCK (IC41.J2)
PG_2V5: Kasli-SOC_PWR (R373.1), Kasli-SOC_QUAD_BUCK (IC41.C2)
PG_3V3: Kasli-SOC_PWR (R388.1), Kasli-SOC_QUAD_BUCK (IC41.F2)
PG_MGTAVCC: Kasli-SOC_PWR (R370.1), Kasli-SOC_linear (IC29.9 IC35.4)
PG_MGTAVTT: Kasli-SOC_PWR (R376.1), Kasli-SOC_linear (IC23.9 IC34.4)
PG_VCCDDR: Kasli-SOC_PWR (R367.1), Kasli-SOC_linear (IC8.9 IC33.4)
PHY_RSTn: Kasli-SOC_bank500-501 (IC6.B19), Kasli-SOC_ETH_PHY (IC40.16 R106.1)
PS_POR: Kasli-SOC_bank500-501 (J24.3), Kasli-SOC_USB_Serial_Quad (IC9.5)
RGMII_RX_CLK: Kasli-SOC_bank500-501 (IC6.G22), Kasli-SOC_ETH_PHY (IC40.46)
RGMII_RX_CTRL: Kasli-SOC_bank500-501 (IC6.F18), Kasli-SOC_ETH_PHY (IC40.43)
RGMII_RXD0: Kasli-SOC_bank500-501 (IC6.F20), Kasli-SOC_ETH_PHY (IC40.44)
RGMII_RXD1: Kasli-SOC_bank500-501 (IC6.J19), Kasli-SOC_ETH_PHY (IC40.45)
RGMII_RXD2: Kasli-SOC_bank500-501 (IC6.F19), Kasli-SOC_ETH_PHY (IC40.47)
RGMII_RXD3: Kasli-SOC_bank500-501 (IC6.H17), Kasli-SOC_ETH_PHY (IC40.48)
RGMII_TX_CLK: Kasli-SOC_bank500-501 (IC6.G21), Kasli-SOC_ETH_PHY (IC40.53)
RGMII_TX_CTRL: Kasli-SOC_bank500-501 (IC6.F22), Kasli-SOC_ETH_PHY (IC40.56)
RGMII_TXD0: Kasli-SOC_bank500-501 (IC6.G17), Kasli-SOC_ETH_PHY (IC40.50)
RGMII_TXD1: Kasli-SOC_bank500-501 (IC6.G20), Kasli-SOC_ETH_PHY (IC40.51)
RGMII_TXD2: Kasli-SOC_bank500-501 (IC6.G19), Kasli-SOC_ETH_PHY (IC40.54)
RGMII_TXD3: Kasli-SOC_bank500-501 (IC6.H19), Kasli-SOC_ETH_PHY (IC40.55)
SFP0_RD_N: Kasli-SOC_bank112 (IC6.AB3), Kasli-SOC_SFP (J19.LB12)
SFP0_RD_P: Kasli-SOC_bank112 (IC6.AB4), Kasli-SOC_SFP (J19.LB13)
SFP0_TD_N: Kasli-SOC_bank112 (IC6.AA1), Kasli-SOC_SFP (J19.LB19)
SFP0_TD_P: Kasli-SOC_bank112 (IC6.AA2), Kasli-SOC_SFP (J19.LB18)
SFP1_RD_N: Kasli-SOC_bank112 (IC6.Y3), Kasli-SOC_SFP (J19.LT12)
SFP1_RD_P: Kasli-SOC_bank112 (IC6.Y4), Kasli-SOC_SFP (J19.LT13)
SFP1_TD_N: Kasli-SOC_bank112 (IC6.W1), Kasli-SOC_SFP (J19.LT19)
SFP1_TD_P: Kasli-SOC_bank112 (IC6.W2), Kasli-SOC_SFP (J19.LT18)
SFP2_RD_N: Kasli-SOC_bank112 (IC6.V3), Kasli-SOC_SFP (J19.RB12)
SFP2_RD_P: Kasli-SOC_bank112 (IC6.V4), Kasli-SOC_SFP (J19.RB13)
SFP2_TD_N: Kasli-SOC_bank112 (IC6.U1), Kasli-SOC_SFP (J19.RB19)
SFP2_TD_P: Kasli-SOC_bank112 (IC6.U2), Kasli-SOC_SFP (J19.RB18)
SFP3_RD_N: Kasli-SOC_bank112 (IC6.T3), Kasli-SOC_SFP (J19.RT12)
SFP3_RD_P: Kasli-SOC_bank112 (IC6.T4), Kasli-SOC_SFP (J19.RT13)
SFP3_TD_N: Kasli-SOC_bank112 (IC6.R1), Kasli-SOC_SFP (J19.RT19)
SFP3_TD_P: Kasli-SOC_bank112 (IC6.R2), Kasli-SOC_SFP (J19.RT18)
SFP_3.SCL: Kasli-SOC_SFP (J19.RT5), Kasli-SOC_MUX_I2C (R235.2)
SFP_3.SDA: Kasli-SOC_SFP (J19.RT4), Kasli-SOC_MUX_I2C (R234.2)
SHARED_SCL: Kasli-SOC_MUX_I2C (9 pins), Kasli-SOC_ClockRecovery (R237.1)
SHARED_SDA: Kasli-SOC_MUX_I2C (9 pins), Kasli-SOC_ClockRecovery (R236.1)
UART_PL_RX: Kasli-SOC_bank13 (IC6.AA18), Kasli-SOC_USB_Serial_Quad (IC37.5 TP10.1)
UART_PL_TX: Kasli-SOC_bank13 (IC6.Y18), Kasli-SOC_USB_Serial_Quad (IC37.4 TP40.1)
UART_PS_RX: Kasli-SOC_bank500-501 (IC6.A18), Kasli-SOC_USB_Serial_Quad (IC20.4 TP17.1)
UART_PS_Rx_1V8: Kasli-SOC_bank500-501 (IC6.B21), Kasli-SOC_USB_Serial_Quad (IC20.5 TP16.1)
USB_SRST_2V5: Kasli-SOC_bank500-501 (IC4.3 R107.1), Kasli-SOC_USB_Serial_Quad (IC16.5), Kasli-SOC_bank0 (J8.14)
USB_TCK_2V5: Kasli-SOC_USB_Serial_Quad (IC17.4 R401.1), Kasli-SOC_bank0 (D15.3 IC6.W12 J8.6)
USB_TDI_2V5: Kasli-SOC_USB_Serial_Quad (IC17.5 R400.1), Kasli-SOC_bank0 (D16.3 IC6.V11 J8.10)
USB_TDO_2V5: Kasli-SOC_USB_Serial_Quad (IC19.4 R403.1), Kasli-SOC_bank0 (D16.2 IC6.W10 J8.8)
USB_TMS_2V5: Kasli-SOC_USB_Serial_Quad (IC19.5 R402.1), Kasli-SOC_bank0 (D15.2 IC6.W11 J8.4)
VUSB_PRESENT_N: Kasli-SOC_MUX_I2C (IC25.27 IC43.10), Kasli-SOC_USB_Serial_Quad (R209.1 T14.3)

## Assembly variants
Si549 CMOS: not fitted C123 C124 C135 C136 C189 C366 C367 C372 C373 C377 C378 C379 IC33 IC34 IC35 IC36 IC38 IC42 IC43 IC44 IC45 J26 R13 R36 R39 R40 R47 R48 R53 R65 R80 R91 R97 R114 R115 R116 R122 R152 R153 R242 R246 R247 R297 R302 R305 R308
Si549 LVDS: not fitted C123 C124 C135 C136 C366 C367 C372 C373 C377 C378 C379 IC33 IC34 IC35 IC36 IC38 IC42 IC43 IC44 IC45 J26 R13 R38 R39 R40 R47 R48 R53 R65 R80 R91 R98 R114 R115 R116 R122 R152 R153 R224 R242 R246 R247 R297 R302 R305 R308; alternate parts R37 -> R0402_0R_JUMPER, R225 -> R0402_0R_JUMPER, OSC1 -> OSC_0.2-800MHZ_SILICON-LAB_549BACB001937ABG, OSC3 -> OSC_0.2-800MHZ_SILICON-LAB_549BACB001937ABG